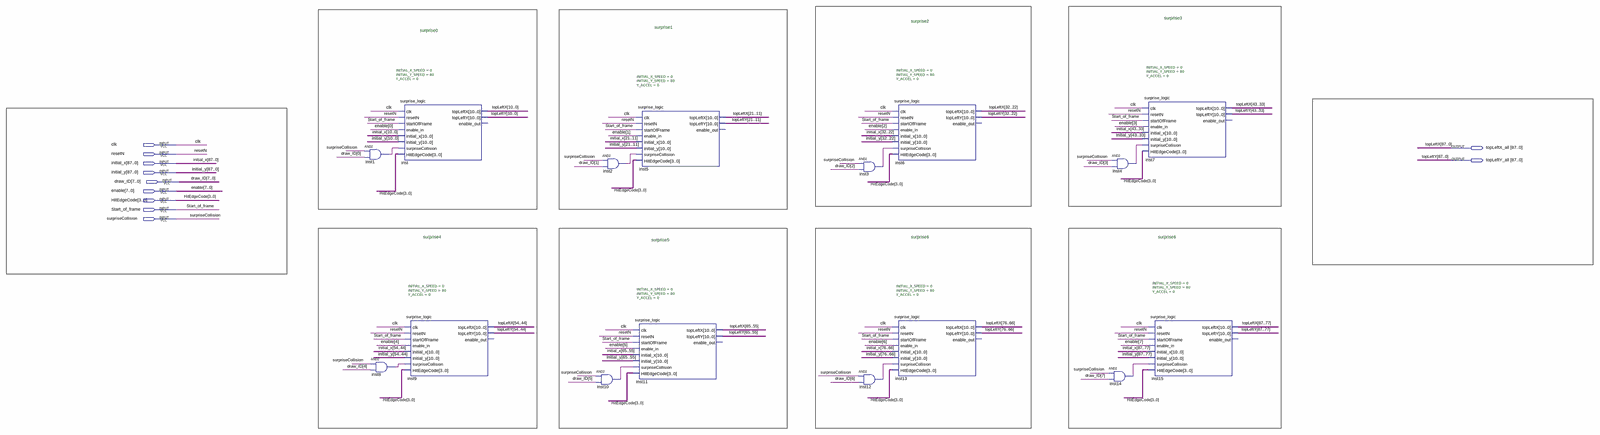
[diagram p0: schematic sheet, whole]
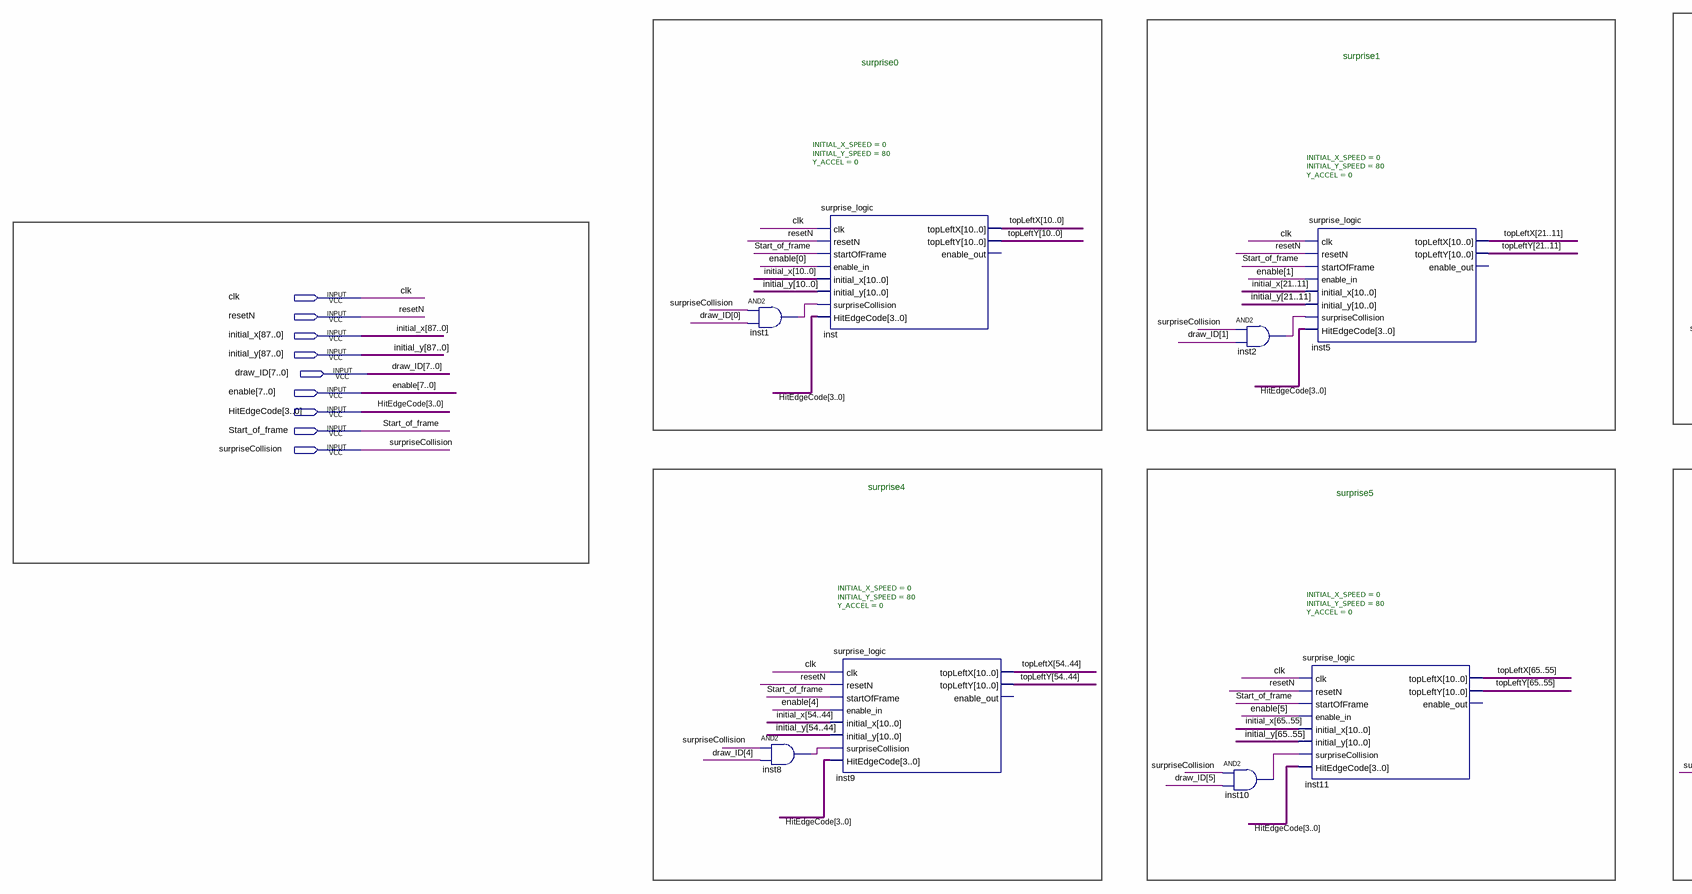
[diagram p1: schematic sheet, left part]
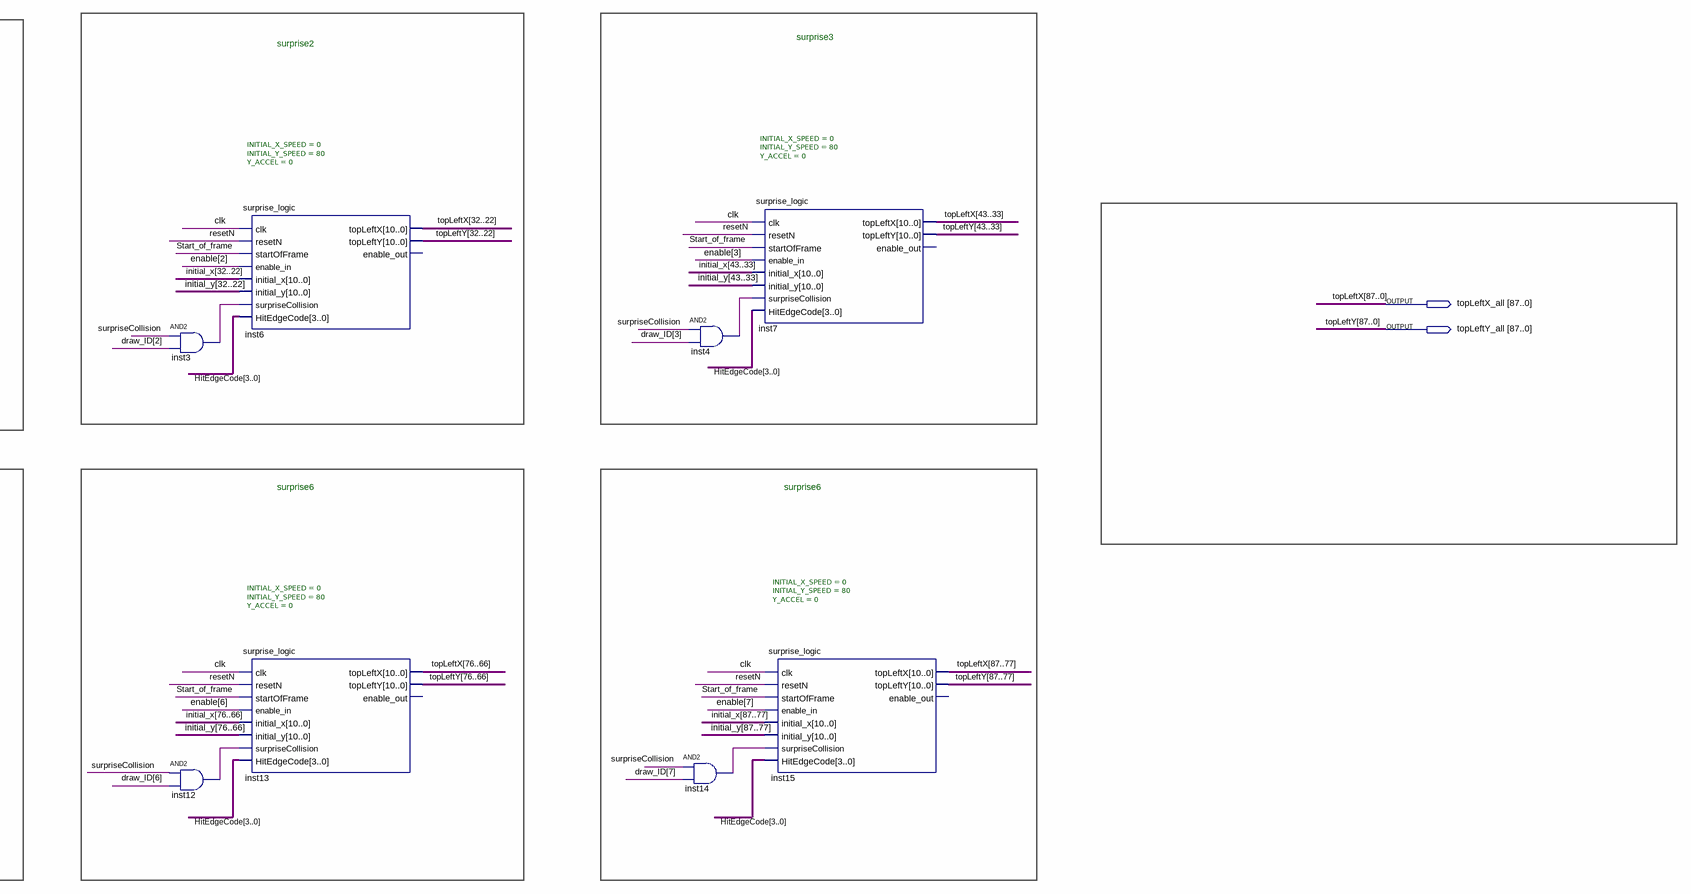
[diagram p2: schematic sheet, right part]
// Quartus schematic surpriseLogicMaster.bdf as structural Verilog: 16 symbols, 11 pins
module surpriseLogicMaster (
  input  clk,
  input  resetN,
  input  [87:0] initial_x,
  input  [87:0] initial_y,
  input  [7:0] draw_ID,
  input  [7:0] enable,
  input  [3:0] HitEdgeCode,
  input  Start_of_frame,
  input  surpriseCollision,
  output [87:0] topLeftX_all,
  output [87:0] topLeftY_all
);

  wire inst1_out, inst2_out, inst3_out, inst4_out, inst8_out, inst10_out, inst12_out, inst14_out;

  and inst1 (inst1_out, surpriseCollision, draw_ID[0]);
  and inst8 (inst8_out, surpriseCollision, draw_ID[4]);
  surprise_logic #(.INITIAL_X_SPEED(0), .INITIAL_Y_SPEED(80), .Y_ACCEL(0)) inst (
    .clk(clk), .resetN(resetN), .startOfFrame(Start_of_frame), .enable_in(enable[0]),
    .initial_x(initial_x[10:0]), .initial_y(initial_y[10:0]), .surpriseCollision(inst1_out),
    .HitEdgeCode(HitEdgeCode), .topLeftX(topLeftX_all[10:0]), .topLeftY(topLeftY_all[10:0]));  // open: enable_out
  surprise_logic #(.INITIAL_X_SPEED(0), .INITIAL_Y_SPEED(80), .Y_ACCEL(0)) inst9 (
    .clk(clk), .resetN(resetN), .startOfFrame(Start_of_frame), .enable_in(enable[4]),
    .initial_x(initial_x[54:44]), .initial_y(initial_y[54:44]), .surpriseCollision(inst8_out),
    .HitEdgeCode(HitEdgeCode), .topLeftX(topLeftX_all[54:44]), .topLeftY(topLeftY_all[54:44]));  // open: enable_out
  and inst2 (inst2_out, surpriseCollision, draw_ID[1]);
  and inst10 (inst10_out, surpriseCollision, draw_ID[5]);
  surprise_logic #(.INITIAL_X_SPEED(0), .INITIAL_Y_SPEED(80), .Y_ACCEL(0)) inst11 (
    .clk(clk), .resetN(resetN), .startOfFrame(Start_of_frame), .enable_in(enable[5]),
    .initial_x(initial_x[65:55]), .initial_y(initial_y[65:55]), .surpriseCollision(inst10_out),
    .HitEdgeCode(HitEdgeCode), .topLeftX(topLeftX_all[65:55]), .topLeftY(topLeftY_all[65:55]));  // open: enable_out
  surprise_logic #(.INITIAL_X_SPEED(0), .INITIAL_Y_SPEED(80), .Y_ACCEL(0)) inst5 (
    .clk(clk), .resetN(resetN), .startOfFrame(Start_of_frame), .enable_in(enable[1]),
    .initial_x(initial_x[21:11]), .initial_y(initial_y[21:11]), .surpriseCollision(inst2_out),
    .HitEdgeCode(HitEdgeCode), .topLeftX(topLeftX_all[21:11]), .topLeftY(topLeftY_all[21:11]));  // open: enable_out
  and inst3 (inst3_out, surpriseCollision, draw_ID[2]);
  and inst12 (inst12_out, surpriseCollision, draw_ID[6]);
  surprise_logic #(.INITIAL_X_SPEED(0), .INITIAL_Y_SPEED(80), .Y_ACCEL(0)) inst6 (
    .clk(clk), .resetN(resetN), .startOfFrame(Start_of_frame), .enable_in(enable[2]),
    .initial_x(initial_x[32:22]), .initial_y(initial_y[32:22]), .surpriseCollision(inst3_out),
    .HitEdgeCode(HitEdgeCode), .topLeftX(topLeftX_all[32:22]), .topLeftY(topLeftY_all[32:22]));  // open: enable_out
  surprise_logic #(.INITIAL_X_SPEED(0), .INITIAL_Y_SPEED(80), .Y_ACCEL(0)) inst13 (
    .clk(clk), .resetN(resetN), .startOfFrame(Start_of_frame), .enable_in(enable[6]),
    .initial_x(initial_x[76:66]), .initial_y(initial_y[76:66]), .surpriseCollision(inst12_out),
    .HitEdgeCode(HitEdgeCode), .topLeftX(topLeftX_all[76:66]), .topLeftY(topLeftY_all[76:66]));  // open: enable_out
  and inst4 (inst4_out, surpriseCollision, draw_ID[3]);
  and inst14 (inst14_out, surpriseCollision, draw_ID[7]);
  surprise_logic #(.INITIAL_X_SPEED(0), .INITIAL_Y_SPEED(80), .Y_ACCEL(0)) inst7 (
    .clk(clk), .resetN(resetN), .startOfFrame(Start_of_frame), .enable_in(enable[3]),
    .initial_x(initial_x[43:33]), .initial_y(initial_y[43:33]), .surpriseCollision(inst4_out),
    .HitEdgeCode(HitEdgeCode), .topLeftX(topLeftX_all[43:33]), .topLeftY(topLeftY_all[43:33]));  // open: enable_out
  surprise_logic #(.INITIAL_X_SPEED(0), .INITIAL_Y_SPEED(80), .Y_ACCEL(0)) inst15 (
    .clk(clk), .resetN(resetN), .startOfFrame(Start_of_frame), .enable_in(enable[7]),
    .initial_x(initial_x[87:77]), .initial_y(initial_y[87:77]), .surpriseCollision(inst14_out),
    .HitEdgeCode(HitEdgeCode), .topLeftX(topLeftX_all[87:77]), .topLeftY(topLeftY_all[87:77]));  // open: enable_out

  // Other names for the same wires on the sheet: topLeftX[87:0] = topLeftX_all; topLeftY[87:0] = topLeftY_all

  // Notes on the sheet:
  //   surprise3
  //   surprise2
  //   surprise1
  //   surprise0
  //   surprise4
  //   surprise6
  //   surprise6
  //   surprise5
endmodule
